# Altium project 2008_SablierElectronique.PrjPcb
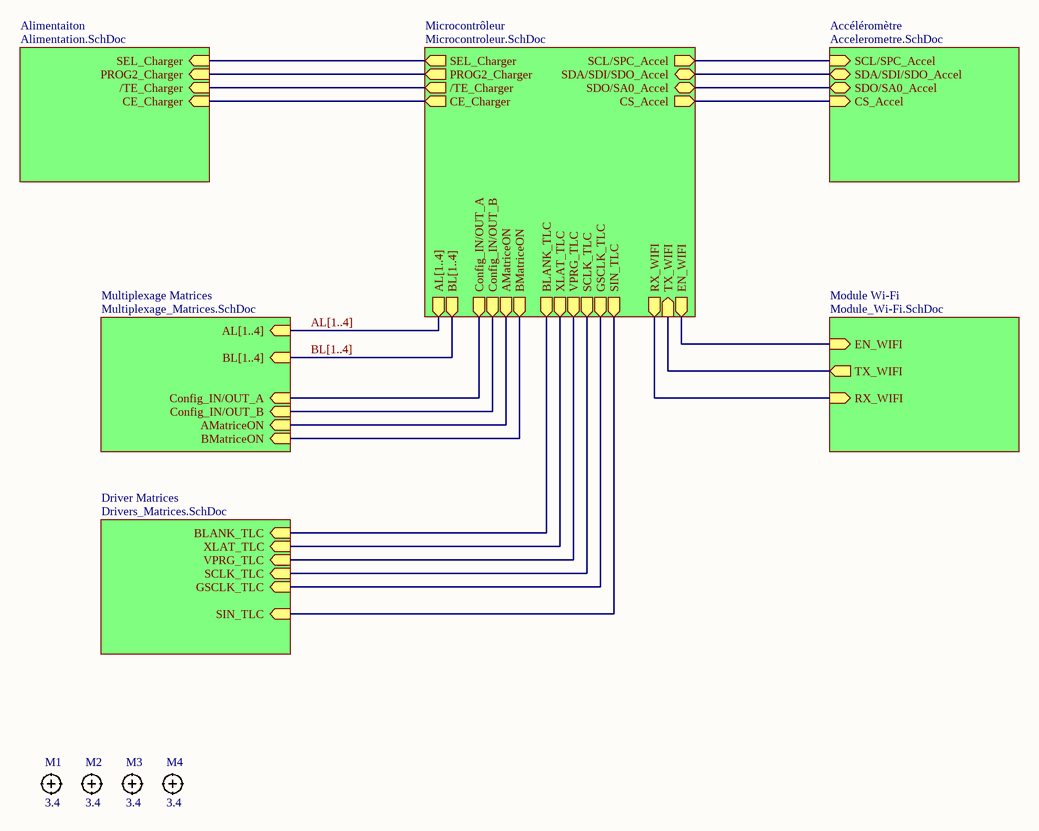
[diagram p0: Schema_bloc.SchDoc]
=ProjectName: 2008_SablierElectronique.PrjPcb
7 sheets, 129 parts. Net scope: hierarchical (ports join the sheet entries above them; power ports are global).
Board file: 2008E_SablierElectronique_JJE.PcbDoc
Sheets:
  Schema_bloc.SchDoc
    Alimentaiton = Alimentation.SchDoc
    Microcontrôleur = Microcontroleur.SchDoc
    Multiplexage Matrices = Multiplexage_Matrices.SchDoc
    Driver Matrices = Drivers_Matrices.SchDoc
    Accéléromètre = Accelerometre.SchDoc
    Module Wi-Fi = Module_Wi-Fi.SchDoc

## Sheet Schema_bloc.SchDoc
size A4; Author: Jérémie Jean-Elie; DrawnBy: Jérémie Jean-Elie; SheetNumber: 1; SheetTotal: 7; Version: E

### Parts
M1  3.4  [MECH-UHD340]  (no BOM)
M2  3.4  [MECH-UHD340]  (no BOM)
M3  3.4  [MECH-UHD340]  (no BOM)
M4  3.4  [MECH-UHD340]  (no BOM)

### Sub-sheets
Accéléromètre = Accelerometre.SchDoc: SCL/SPC_Accel (in), SDA/SDI/SDO_Accel (bidir), SDO/SA0_Accel (bidir), CS_Accel (in)
Alimentaiton = Alimentation.SchDoc: SEL_Charger (in), PROG2_Charger (in), /TE_Charger (in), CE_Charger (in)
Driver Matrices = Drivers_Matrices.SchDoc: BLANK_TLC (in), XLAT_TLC (in), VPRG_TLC (in), SCLK_TLC (in), GSCLK_TLC (in), SIN_TLC (in)
Microcontrôleur = Microcontroleur.SchDoc: SEL_Charger (out), PROG2_Charger (out), /TE_Charger (out), CE_Charger (out), EN_WIFI (out), TX_WIFI (in), RX_WIFI (out), AL[1..4] (out), BL[1..4] (out), BLANK_TLC (out), XLAT_TLC (out), VPRG_TLC (out), SCLK_TLC (out), GSCLK_TLC (out), Config_IN/OUT_B (out), AMatriceON (out), BMatriceON (out), SIN_TLC (out), Config_IN/OUT_A (out), SCL/SPC_Accel (out), SDA/SDI/SDO_Accel (bidir), SDO/SA0_Accel (bidir), CS_Accel (out)
Module Wi-Fi = Module_Wi-Fi.SchDoc: EN_WIFI (in), TX_WIFI (out), RX_WIFI (in)
Multiplexage Matrices = Multiplexage_Matrices.SchDoc: AL[1..4] (in), BL[1..4] (in), Config_IN/OUT_A (in), AMatriceON (in), BMatriceON (in), Config_IN/OUT_B (in)

### Nets
BLANK_TLC: sheet Microcontrôleur/BLANK_TLC, sheet Driver Matrices/BLANK_TLC
CS_Accel: sheet Microcontrôleur/CS_Accel, sheet Accéléromètre/CS_Accel
GSCLK_TLC: sheet Microcontrôleur/GSCLK_TLC, sheet Driver Matrices/GSCLK_TLC
RX_WIFI: sheet Microcontrôleur/RX_WIFI, sheet Module Wi-Fi/RX_WIFI
SCL/SPC_Accel: sheet Microcontrôleur/SCL/SPC_Accel, sheet Accéléromètre/SCL/SPC_Accel
SCLK_TLC: sheet Microcontrôleur/SCLK_TLC, sheet Driver Matrices/SCLK_TLC
SDA/SDI/SDO_Accel: sheet Microcontrôleur/SDA/SDI/SDO_Accel, sheet Accéléromètre/SDA/SDI/SDO_Accel
SDO/SA0_Accel: sheet Microcontrôleur/SDO/SA0_Accel, sheet Accéléromètre/SDO/SA0_Accel
SIN_TLC: sheet Microcontrôleur/SIN_TLC, sheet Driver Matrices/SIN_TLC
TX_WIFI: sheet Microcontrôleur/TX_WIFI, sheet Module Wi-Fi/TX_WIFI
VPRG_TLC: sheet Microcontrôleur/VPRG_TLC, sheet Driver Matrices/VPRG_TLC
XLAT_TLC: sheet Microcontrôleur/XLAT_TLC, sheet Driver Matrices/XLAT_TLC
NetTP7_1: sheet Microcontrôleur/Config_IN/OUT_B, sheet Multiplexage Matrices/Config_IN/OUT_B
NetU2_3: sheet Alimentaiton/SEL_Charger, sheet Microcontrôleur/SEL_Charger
NetU2_4: sheet Alimentaiton/PROG2_Charger, sheet Microcontrôleur/PROG2_Charger
NetU2_9: sheet Alimentaiton//TE_Charger, sheet Microcontrôleur//TE_Charger
NetU2_17: sheet Alimentaiton/CE_Charger, sheet Microcontrôleur/CE_Charger
NetU3_1: sheet Microcontrôleur/Config_IN/OUT_A, sheet Multiplexage Matrices/Config_IN/OUT_A
NetU3_15: sheet Microcontrôleur/AMatriceON, sheet Multiplexage Matrices/AMatriceON
NetU4_15: sheet Microcontrôleur/BMatriceON, sheet Multiplexage Matrices/BMatriceON
NetU7_60: sheet Microcontrôleur/EN_WIFI, sheet Module Wi-Fi/EN_WIFI

### Buses and harness runs
bus AL[1..4] = sheet Microcontrôleur/AL[1..4] = sheet Multiplexage Matrices/AL[1..4]
bus BL[1..4] = sheet Microcontrôleur/BL[1..4] = sheet Multiplexage Matrices/BL[1..4]

### Notes on the sheet
- Fichier :
- a
- Date :
- Heure :
- Version :
- Auteur :
- Modif.
- b
- c
- d
- Projet :
- No :
- Nb feuilles
- Feuille n°
- Chemin :

### Library data of the parts
M1-M4 = CMP-063-000009-1: Unplated Hole 3.4mm; PN: PN-491366; IsStocked: False; SubCategory: Mecaniques; Category: Others; Value: 3.4

## Sheet Alimentation.SchDoc
size A4; Author: Jérémie Jean-Elie; Organization: ETML-ES; Address1: Avenue Recordon 1; Address2: 1004 Lausanne; Address3: Switzerland; Revision: 1; SheetNumber: 2; SheetTotal: 7; Version: E
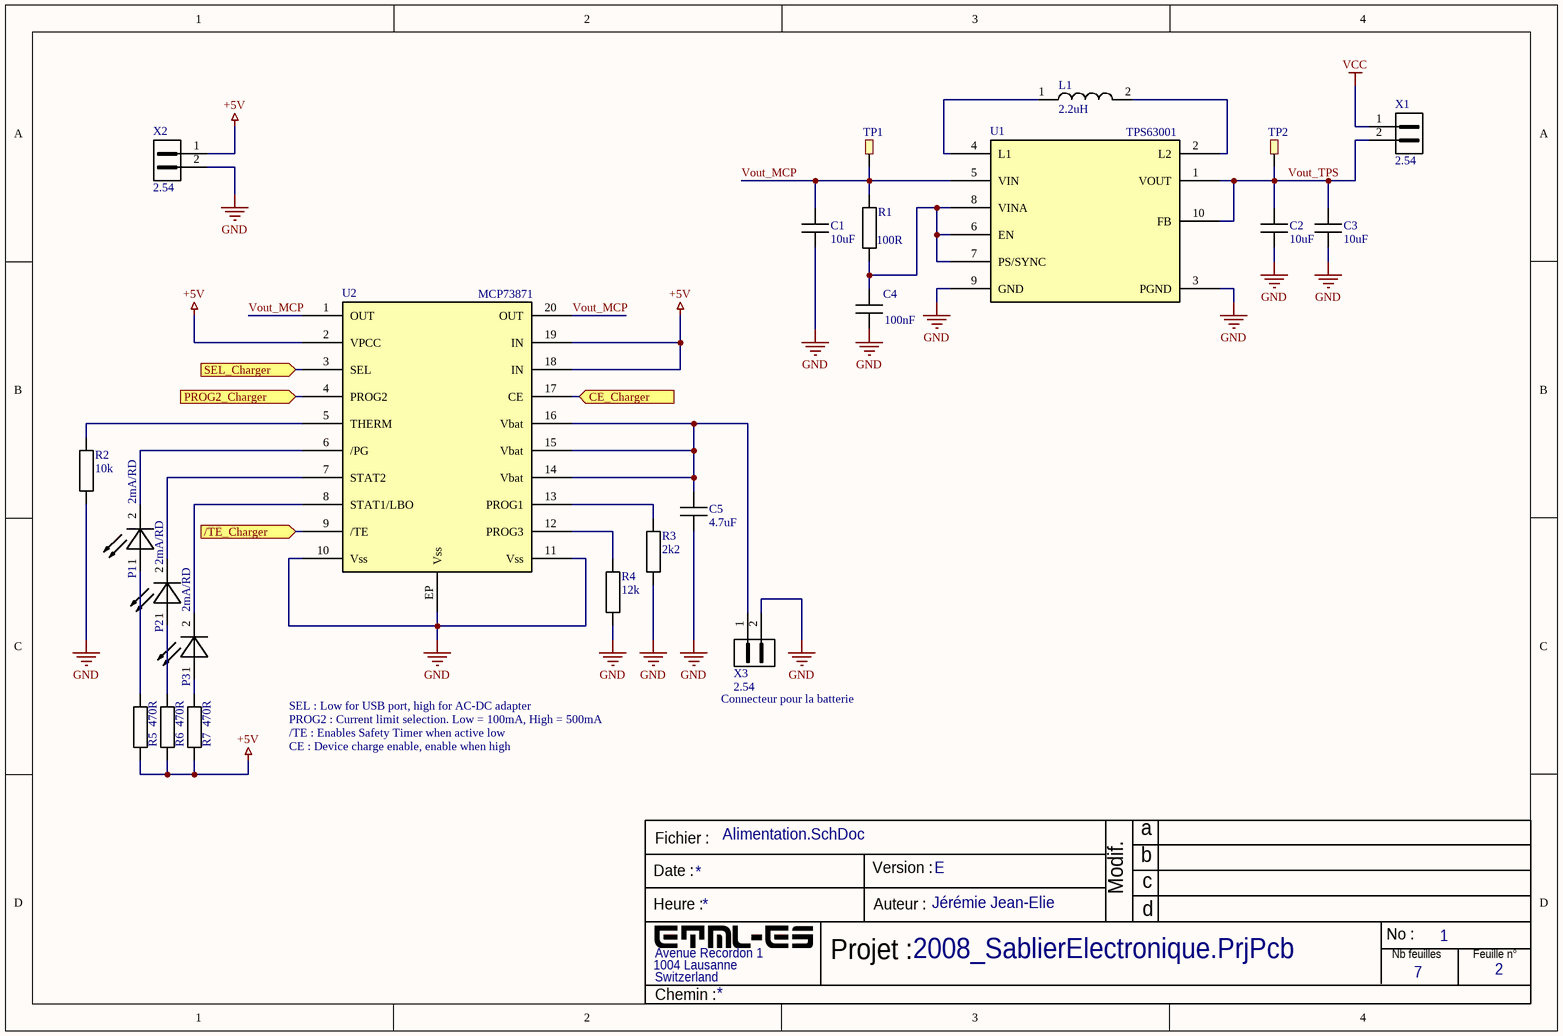
[diagram p1: Alimentation.SchDoc]

### Parts
C1  10uF  [CAPC1608X08M]
C2  10uF  [CAPC1608X08M]
C3  10uF  [CAPC1608X08M]
C4  100nF  [CAPC1608X08M]
C5  4.7uF  [CAPC1608X08M]
L1  2.2uH  [IND_2.2uH]
P1  2mA/RD  [LED-PLCC2]
P2  2mA/RD  [LED-PLCC2]
P3  2mA/RD  [LED-PLCC2]
R1  100R  [RESC1608X06M]
R2  10k  [RESC1608X06M]
R3  2k2  [RESC1608X06M]
R4  12k  [RESC1608X06M]
R5  470R  [RESC1608X06M]
R6  470R  [RESC1608X06M]
R7  470R  [RESC1608X06M]
TP1  TestPoint  [KEYSTONE_5019]  (value not drawn)
TP2  TestPoint  [KEYSTONE_5019]  (value not drawn)
U1  TPS63001  [DRC0010J]
U2  MCP73871  [QFN50P400X400X100_HS-21N]
X1  2.54  [PIN-1x02-2.54]
X2  2.54  [PIN-1x02-2.54]
X3  2.54  [PIN-1x02-2.54]

### Ports
/TE_Charger (in, see Schema_bloc[2A], Microcontroleur[4B]), CE_Charger (in, see Schema_bloc[2A], Microcontroleur[4B]), PROG2_Charger (in, see Schema_bloc[2A], Microcontroleur[4B]), SEL_Charger (in, see Schema_bloc[2A], Microcontroleur[4B])

### Nets
+5V: R5.1 R6.1 R7.1 U2.2(VPCC) U2.18(IN) U2.19(IN) X2.1
GND: C1.1 C2.1 C3.1 C4.1 C5.1 R2.1 R3.1 R4.1 U1.3(PGND) U1.9(GND) U2.10(Vss) U2.11(Vss) U2.EP(Vss) X2.2 X3.2
VCC: X1.1
Vout_MCP: C1.2 R1.2 TP1.1 U1.5(VIN) U2.1(OUT) U2.20(OUT)
Vout_TPS: C2.2 C3.2 TP2.1 U1.1(VOUT) U1.10(FB) X1.2
NetC4_2: C4.2 R1.1 U1.6(EN) U1.7(PS/SYNC) U1.8(VINA)
NetC5_2: C5.2 U2.14(Vbat) U2.15(Vbat) U2.16(Vbat) X3.1
NetL1_1: L1.1 U1.4(L1)
NetL1_2: L1.2 U1.2(L2)
NetP1_1: P1.1(A) R5.2
NetP1_2: P1.2(K) U2.6(/PG)
NetP2_1: P2.1(A) R6.2
NetP2_2: P2.2(K) U2.7(STAT2)
NetP3_1: P3.1(A) R7.2
NetP3_2: P3.2(K) U2.8(STAT1/LBO)
NetR2_2: R2.2 U2.5(THERM)
NetR3_2: R3.2 U2.13(PROG1)
NetR4_2: R4.2 U2.12(PROG3)
NetU2_3: U2.3(SEL) ; port SEL_Charger
NetU2_4: U2.4(PROG2) ; port PROG2_Charger
NetU2_9: U2.9(/TE) ; port /TE_Charger
NetU2_17: U2.17(CE) ; port CE_Charger

### Notes on the sheet
- SEL : Low for USB port, high for AC-DC adapter
- Connecteur pour la batterie
- PROG2 : Current limit selection. Low = 100mA, High = 500mA
- /TE : Enables Safety Timer when active low
- CE : Device charge enable, enable when high
- Fichier :
- a
- Date :
- Heure :
- Version :
- Auteur :
- Modif.
- b
- c
- d
- Projet :
- No :
- Nb feuilles
- Feuille n°
- Chemin :

### Library data of the parts
C1-C3 = CMP-065-000003-2: CAPC 10uF X5R 10V 20% 1608 (0603 INCH); Manufacturer: TDK; Manufacturer Number: C1608X5R1A106M080AC; TemperatureRange: -55°C to +85°C; IsStocked: 1; Value: 10µF; PN: PN-131657; Supplier Price 1: 0.0944; Tolerance: ±20%; Category: Passives; Dielectric: X5R; SubCategory: Condensateurs ceramique; Supplier 1: ETML; Voltage: 10V; Supplier Part Number 1: FAB.0603_C 10uF
C4 = CMP-065-000000-2: CAPC 100nF X7R 50V 10% 1608 (0603 INCH); Manufacturer: TDK; Manufacturer Number: CGA3E2X7R1H104K080AA; IsStocked: 1; PN: PN-338083; Current: NULL; TemperatureRange: -55°C to +125°C; Voltage: 50V; Dielectric: X7R; Value: 100nF; Category: Passives; Supplier Price 1: 0.0100; Supplier Part Number 1: FAB.0603_C 100n; SubCategory: Condensateurs ceramique; Tolerance: ±10%; Supplier 1: ETML; TemperatureCoeff: NULL; Power: NULL
C5 = CMP-065-000006-2: CAPC 4.7uF X5R 16V 10% 1608 (0603 INCH); Manufacturer: TDK; Manufacturer Number: C1608X5R1C475K080AC; TemperatureRange: -55°C to +85°C; IsStocked: 1; Value: 4.7µF; PN: PN-938781; Voltage: 16V; SubCategory: Condensateurs ceramique; Tolerance: ±10%; Dielectric: X5R; Supplier Price 1: 0.0453; Supplier Part Number 1: FAB.0603_C 4.7uF; Supplier 1: ETML; Category: Passives
P1-P3 = CMP-062-000009-1: LED 2 mA 2.2V 625nm Red PLCC2; Manufacturer Number: VLMT3100-GS08; Manufacturer: Vishay; Current: 2mA; TemperatureRange: -40°C to +100°C; PN: PN-800195; IsStocked: True; Supplier 1: Farnell; Value: 2mA/RD; Category: Optoelectronics; Supplier Price 1: 0.179; Supplier Part Number 1: 2251489; Voltage: 2.2V; SubCategory: Leds
R1 = CMP-066-000100-2: RES 100ohm  ±1% 0.1W  1608 (0603 INCH); Manufacturer Number: RC0603FR-07100RL; Manufacturer: Yageo; TemperatureCoeff: ±100ppm/°C; Voltage: 75V; PN: PN-739787; TemperatureRange: -55°C to 155°C; Value: 100; IsStocked: 1; Supplier Price 1: 0.0200; Category: Passives; Tolerance: ±1%; Supplier 1: ETML; Supplier Part Number 1: FAB.0603_R 100R; Power: 0.1W; SubCategory: Resistances couche epaisse
R2 = CMP-066-000124-2: RES 10kohm  ±1% 0.1W  1608 (0603 INCH); Manufacturer Number: RC0603FR-0710KL; Manufacturer: Yageo; TemperatureRange: -55°C to 155°C; Voltage: 75V; TemperatureCoeff: ±100ppm/°C; PN: PN-896786; IsStocked: 1; Category: Passives; Tolerance: ±1%; Value: 10k; Supplier Part Number 1: FAB.0603_R 10k; Power: 0.1W; Supplier Price 1: 0.0200; Supplier 1: ETML; SubCategory: Resistances couche epaisse
R3 = CMP-066-000116-2: RES 2.2kohm  ±1% 0.1W  1608 (0603 INCH); Manufacturer Number: RC0603FR-072K2L; Manufacturer: Yageo; TemperatureCoeff: ±100ppm/°C; TemperatureRange: -55°C to 155°C; IsStocked: 1; Voltage: 75V; PN: PN-844453; Value: 2.2k; Power: 0.1W; Category: Passives; Supplier Part Number 1: FAB.0603_R 2k2; Supplier 1: ETML; SubCategory: Resistances couche epaisse; Supplier Price 1: 0.0200; Tolerance: ±1%
R4 = CMP-066-000125-2: RES 12kohm  ±1% 0.1W  1608 (0603 INCH); Manufacturer Number: RC0603FR-0712KL; Manufacturer: Yageo; IsStocked: 1; Voltage: 75V; TemperatureCoeff: ±100ppm/°C; TemperatureRange: -55°C to 155°C; PN: PN-565828; Value: 12k; Tolerance: ±1%; Supplier Price 1: 0.0200; Supplier Part Number 1: FAB.0603_R 12k; Power: 0.1W; Category: Passives; SubCategory: Resistances couche epaisse; Supplier 1: ETML
R5-R7 = CMP-066-000108-2: RES 470ohm  ±1% 0.1W  1608 (0603 INCH); Manufacturer Number: RC0603FR-07470RL; Manufacturer: Yageo; Voltage: 75V; Value: 470; TemperatureCoeff: ±100ppm/°C; PN: PN-792120; TemperatureRange: -55°C to 155°C; IsStocked: 1; SubCategory: Resistances couche epaisse; Power: 0.1W; Tolerance: ±1%; Category: Passives; Supplier 1: ETML; Supplier Price 1: 0.0200; Supplier Part Number 1: FAB.0603_R 470R
X1-X3 = CMP-055-000006-1: PIN HEADER 2.54 1x02; Manufacturer Number: 61300211121; Manufacturer: Würth Electronik; IsStocked: True; PN: PN-573903; Voltage: 250V; Current: 3A; TemperatureRange: -40°C to +105°C; Supplier Part Number 1: MAG.283.897; Supplier Price 1: 0.04; Supplier 1: ETML; SubCategory: Pin Header; Category: Connectors; Value: 2.54
U1 = TPS63001: Supplier 1: DigiKey; Supplier Part Number 1: 296-32517-1-ND

## Sheet Microcontroleur.SchDoc
size A3; Version: E; Author: Jérémie Jean-Elie; Organization: ETML-ES; Address1: Avenue Recordon 1; Address2: 1004 Lausanne; Address3: Switzerland; Revision: 1; SheetNumber: 5; SheetTotal: 7
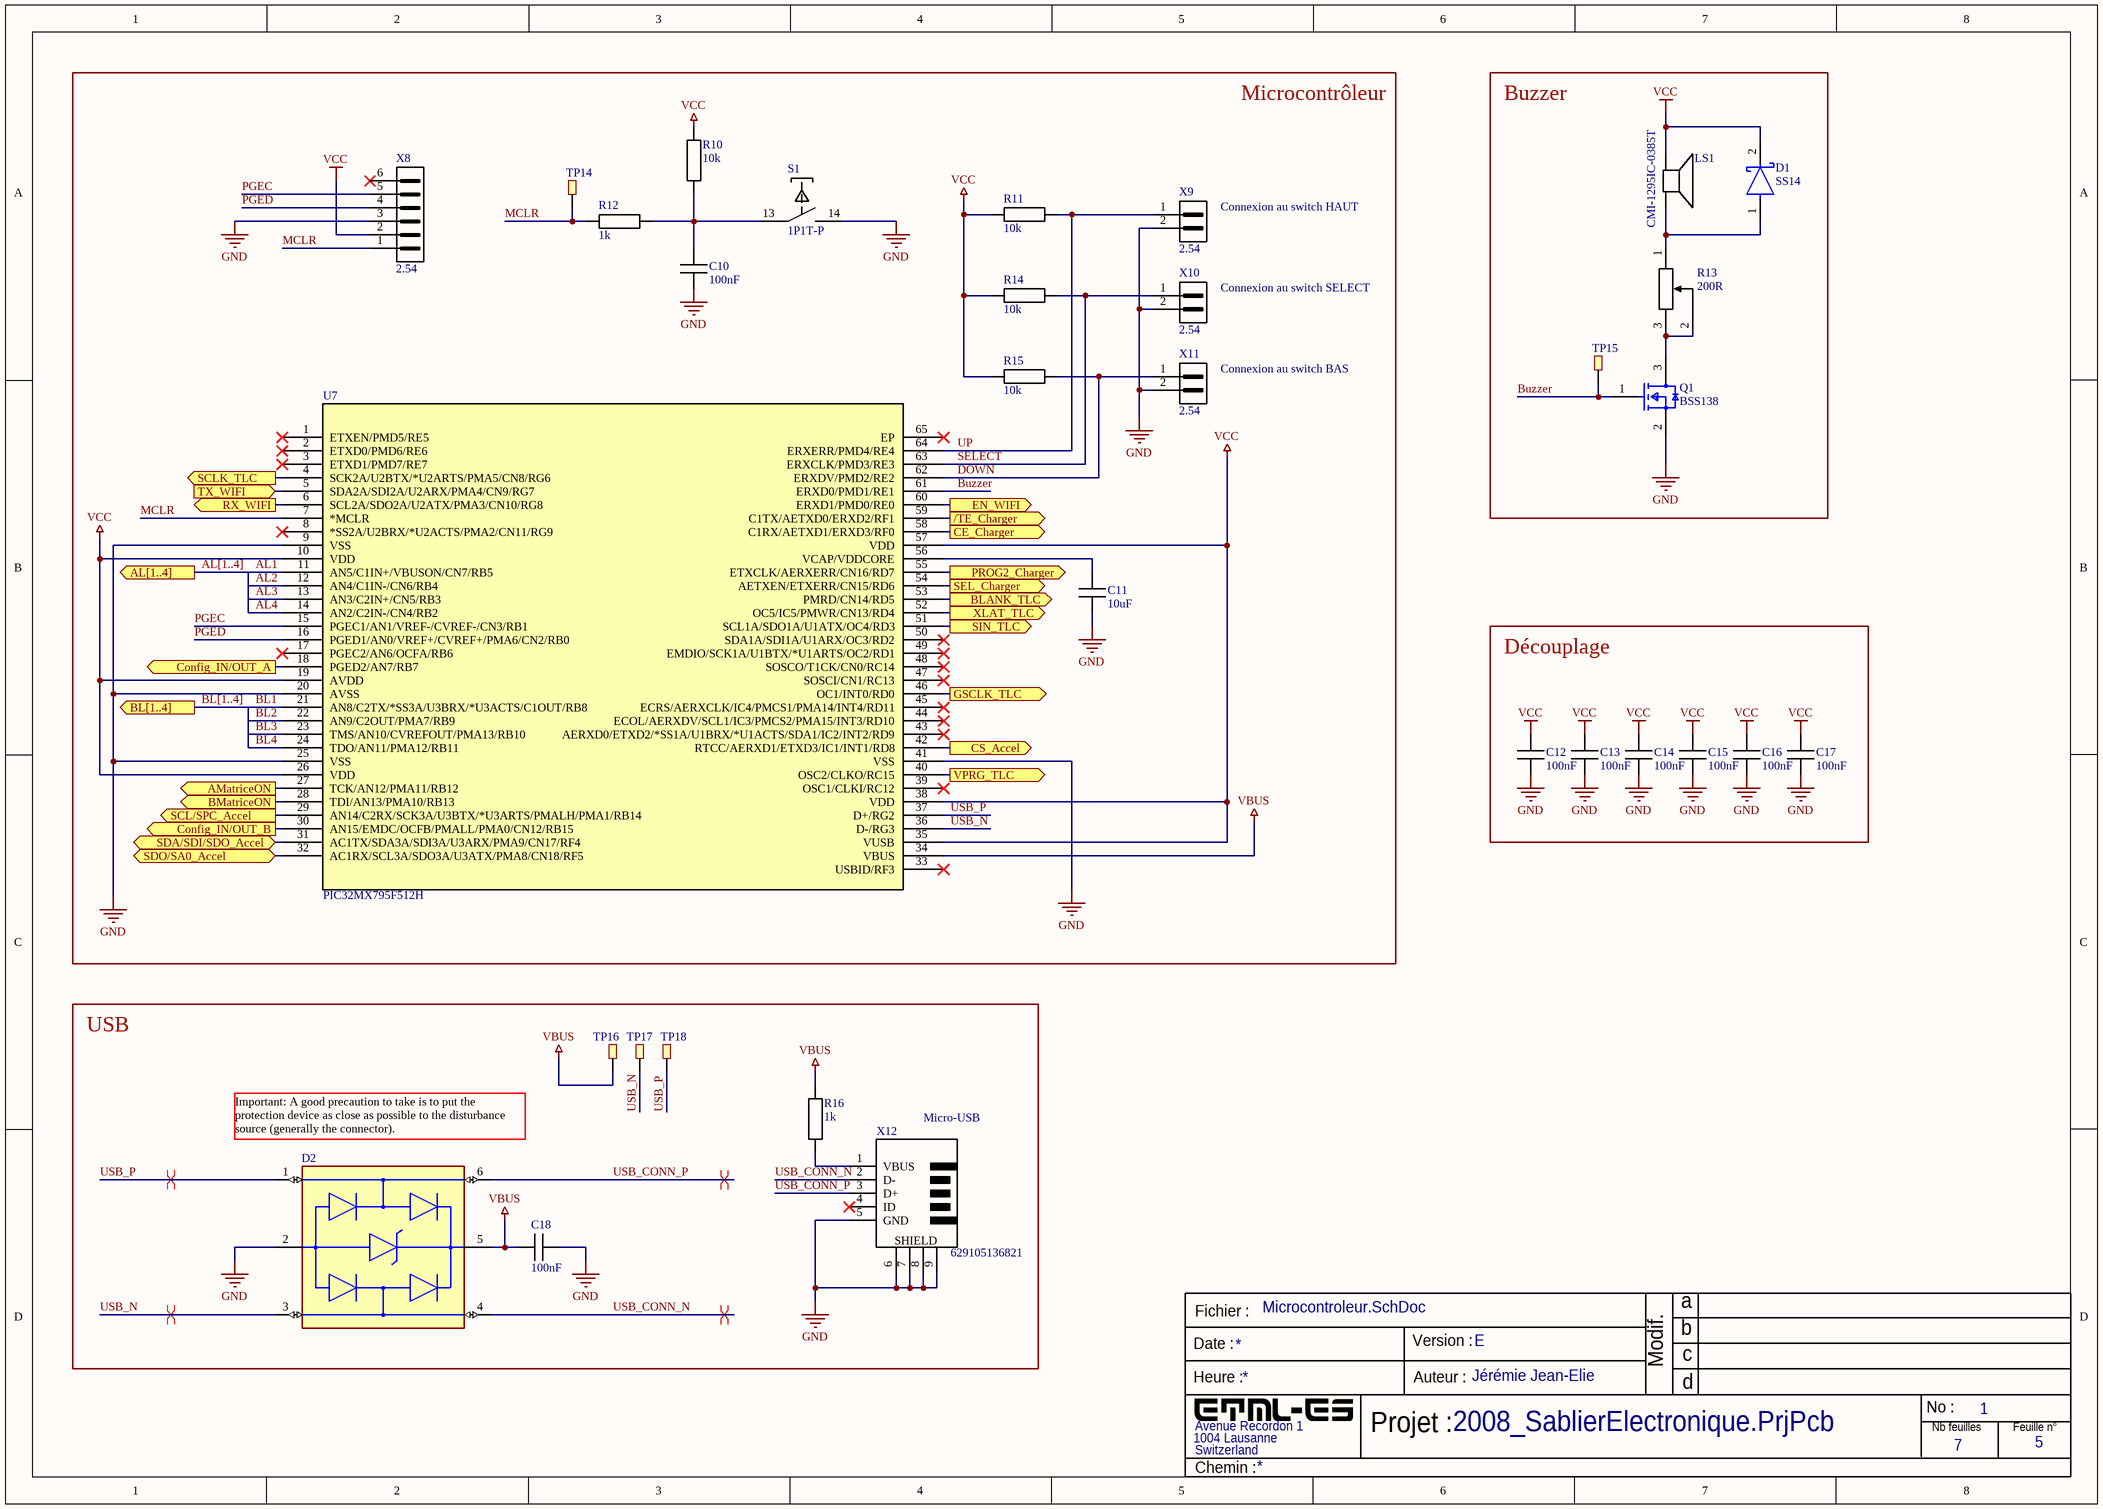
[diagram p2: Microcontroleur.SchDoc]

### Parts
C10  100nF  [CAPC1608X08M]
C11  10uF  [CAPC1608X08M]
C12  100nF  [CAPC1608X08M]
C13  100nF  [CAPC1608X08M]
C14  100nF  [CAPC1608X08M]
C15  100nF  [CAPC1608X08M]
C16  100nF  [CAPC1608X08M]
C17  100nF  [CAPC1608X08M]
C18  100nF  [CAPC1608X08M]
D1  SS14  [FP-403AE-MFG]
D2  USBLC6-2P6  [SOT95P280X145-6N]  (value not drawn)
LS1  CMI-1295IC-0385T  [CMI-1295IC-0385T]
Q1  BSS138  [FP-318-08-IPC_B]
R10  10k  [RESC1608X06M]
R11  10k  [RESC1608X06M]
R12  1k  [RESC1608X06M]
R13  200R  [POT_200r]
R14  10k  [RESC1608X06M]
R15  10k  [RESC1608X06M]
R16  1k  [RESC1608X06M]
S1  1P1T-P  [TE_1825910-6]
TP14  TestPoint  [KEYSTONE_5019]  (value not drawn)
TP15  TestPoint  [KEYSTONE_5019]  (value not drawn)
TP16  TestPoint  [KEYSTONE_5019]  (value not drawn)
TP17  TestPoint  [KEYSTONE_5019]  (value not drawn)
TP18  TestPoint  [KEYSTONE_5019]  (value not drawn)
U7  PIC32MX795F512H  [TQFP64_10x10MC_MCH]
X8  2.54  [PIN-1x06-2.54]
X9  2.54  [PIN-1x02-2.54]
X10  2.54  [PIN-1x02-2.54]
X11  2.54  [PIN-1x02-2.54]
X12  629105136821  [WE_629105136821]

### Blocks framed on the sheet
Microcontrôleur: C10 C11 R10-R12 R14 R15 S1 TP14 U7 X8-X11
Buzzer: D1 LS1 Q1 R13 TP15
Découplage: C12-C17
USB: C18 D2 R16 TP16-TP18 X12

### Ports
/TE_Charger (out, see Schema_bloc[2A], Alimentation[1C]), AL[1..4] (out, see Schema_bloc[2B], Multiplexage_Matrices[3B]), AMatriceON (out, see Schema_bloc[2B], Multiplexage_Matrices[2B]), BL[1..4] (out, see Schema_bloc[2B], Multiplexage_Matrices[3C]), BLANK_TLC (out, see Schema_bloc[2B], Drivers_Matrices[1A]), BMatriceON (out, see Schema_bloc[2B], Multiplexage_Matrices[2C]), CE_Charger (out, see Schema_bloc[2A], Alimentation[2B]), Config_IN/OUT_A (out, see Schema_bloc[2B], Multiplexage_Matrices[1A]), Config_IN/OUT_B (out, see Schema_bloc[2B], Multiplexage_Matrices[1B]), CS_Accel (out, see Schema_bloc[3A], Accelerometre[1B]), EN_WIFI (out, see Schema_bloc[3B], Module_Wi-Fi[1A]), GSCLK_TLC (out, see Schema_bloc[3B], Drivers_Matrices[1A]), PROG2_Charger (out, see Schema_bloc[2A], Alimentation[1B]), RX_WIFI (out, see Schema_bloc[3B], Module_Wi-Fi[1B]), SCL/SPC_Accel (out, see Schema_bloc[3A], Accelerometre[1B]), SCLK_TLC (out, see Schema_bloc[2B], Drivers_Matrices[1A]), SDA/SDI/SDO_Accel (bidir, see Schema_bloc[3A], Accelerometre[1B]), SDO/SA0_Accel (bidir, see Schema_bloc[3A], Accelerometre[1B]), SEL_Charger (out, see Schema_bloc[2A], Alimentation[1B]), SIN_TLC (out, see Schema_bloc[3B], Drivers_Matrices[1B]), TX_WIFI (in, see Schema_bloc[3B], Module_Wi-Fi[1B]), VPRG_TLC (out, see Schema_bloc[2B], Drivers_Matrices[1A]), XLAT_TLC (out, see Schema_bloc[2B], Drivers_Matrices[1A])

### Nets
GND: C10.1 C11.1 C12.1 C13.1 C14.1 C15.1 C16.1 C17.1 C18.2 D2.2(GND) Q1.2(S) S1.14 U7.9(VSS) U7.20(AVSS) U7.25(VSS) U7.41(VSS) X8.3 X9.2 X10.2 X11.2 X12.5(GND) X12.6(SHIELD) X12.7(SHIELD) X12.8(SHIELD) X12.9(SHIELD)
VBUS: C18.1 D2.5(VBUS) R16.2 TP16.1 U7.34(VBUS)
VCC: C12.2 C13.2 C14.2 C15.2 C16.2 C17.2 D1.2(C) LS1.1(+) R10.2 R11.2 R14.2 R15.2 U7.10(VDD) U7.19(AVDD) U7.26(VDD) U7.35(VUSB) U7.38(VDD) U7.57(VDD) X8.2
AL1: U7.11(AN5/C1IN+/VBUSON/CN7/RB5)
AL2: U7.12(AN4/C1IN-/CN6/RB4)
AL3: U7.13(AN3/C2IN+/CN5/RB3)
AL4: U7.14(AN2/C2IN-/CN4/RB2)
BL1: U7.21(AN8/C2TX/*SS3A/U3BRX/*U3ACTS/C1OUT/RB8)
BL2: U7.22(AN9/C2OUT/PMA7/RB9)
BL3: U7.23(TMS/AN10/CVREFOUT/PMA13/RB10)
BL4: U7.24(TDO/AN11/PMA12/RB11)
BLANK_TLC: U7.53(PMRD/CN14/RD5) ; port BLANK_TLC
Buzzer: Q1.1(G) TP15.1 U7.61(ERXD0/PMD1/RE1)
CS_Accel: U7.42(RTCC/AERXD1/ETXD3/IC1/INT1/RD8) ; port CS_Accel
DOWN: R15.1 U7.62(ERXDV/PMD2/RE2) X11.1
GSCLK_TLC: U7.46(OC1/INT0/RD0) ; port GSCLK_TLC
MCLR: R12.1 TP14.1 U7.7(*MCLR) X8.1
PGEC: U7.15(PGEC1/AN1/VREF-/CVREF-/CN3/RB1) X8.5
PGED: U7.16(PGED1/AN0/VREF+/CVREF+/PMA6/CN2/RB0) X8.4
RX_WIFI: U7.6(SCL2A/SDO2A/U2ATX/PMA3/CN10/RG8) ; port RX_WIFI
SCL/SPC_Accel: U7.29(AN14/C2RX/SCK3A/U3BTX/*U3ARTS/PMALH/PMA1/RB14) ; port SCL/SPC_Accel
SCLK_TLC: U7.4(SCK2A/U2BTX/*U2ARTS/PMA5/CN8/RG6) ; port SCLK_TLC
SDA/SDI/SDO_Accel: U7.31(AC1TX/SDA3A/SDI3A/U3ARX/PMA9/CN17/RF4) ; port SDA/SDI/SDO_Accel
SDO/SA0_Accel: U7.32(AC1RX/SCL3A/SDO3A/U3ATX/PMA8/CN18/RF5) ; port SDO/SA0_Accel
SELECT: R14.1 U7.63(ERXCLK/PMD3/RE3) X10.1
SIN_TLC: U7.51(SCL1A/SDO1A/U1ATX/OC4/RD3) ; port SIN_TLC
TX_WIFI: U7.5(SDA2A/SDI2A/U2ARX/PMA4/CN9/RG7) ; port TX_WIFI
UP: R11.1 U7.64(ERXERR/PMD4/RE4) X9.1
USB_CONN_N: D2.4(I/O2) X12.2(D-)
USB_CONN_P: D2.6(I/O1) X12.3(D+)
USB_N: D2.3(I/O2) TP17.1 U7.36(D-/RG3)
USB_P: D2.1(I/O1) TP18.1 U7.37(D+/RG2)
VPRG_TLC: U7.40(OSC2/CLKO/RC15) ; port VPRG_TLC
XLAT_TLC: U7.52(OC5/IC5/PMWR/CN13/RD4) ; port XLAT_TLC
NetC10_2: C10.2 R10.1 R12.2 S1.13
NetC11_2: C11.2 U7.56(VCAP/VDDCORE)
NetD1_1: D1.1(A) LS1.2(-) R13.1
NetQ1_3: Q1.3(D) R13.2 R13.3
NetR16_1: R16.1 X12.1(VBUS)
NetTP7_1: U7.30(AN15/EMDC/OCFB/PMALL/PMA0/CN12/RB15) ; port Config_IN/OUT_B
NetU2_3: U7.54(AETXEN/ETXERR/CN15/RD6) ; port SEL_Charger
NetU2_4: U7.55(ETXCLK/AERXERR/CN16/RD7) ; port PROG2_Charger
NetU2_9: U7.59(C1TX/AETXD0/ERXD2/RF1) ; port /TE_Charger
NetU2_17: U7.58(C1RX/AETXD1/ERXD3/RF0) ; port CE_Charger
NetU3_1: U7.18(PGED2/AN7/RB7) ; port Config_IN/OUT_A
NetU3_15: U7.27(TCK/AN12/PMA11/RB12) ; port AMatriceON
NetU4_15: U7.28(TDI/AN13/PMA10/RB13) ; port BMatriceON
NetU7_60: U7.60(ERXD1/PMD0/RE0) ; port EN_WIFI

Not connected (* = marked no-connect by the designer): U7 1(ETXEN/PMD5/RE5)* 2(ETXD0/PMD6/RE6)* 3(ETXD1/PMD7/RE7)* 8(*SS2A/U2BRX/*U2ACTS/PMA2/CN11/RG9)* 17(PGEC2/AN6/OCFA/RB6)* 33(USBID/RF3)* 39(OSC1/CLKI/RC12)* 43(AERXD0/ETXD2/*SS1A/U1BRX/*U1ACTS/SDA1/IC2/INT2/RD9)* 44(ECOL/AERXDV/SCL1/IC3/PMCS2/PMA15/INT3/RD10)* 45(ECRS/AERXCLK/IC4/PMCS1/PMA14/INT4/RD11)* 47(SOSCI/CN1/RC13)* 48(SOSCO/T1CK/CN0/RC14)* 49(EMDIO/SCK1A/U1BTX/*U1ARTS/OC2/RD1)* 50(SDA1A/SDI1A/U1ARX/OC3/RD2)* 65(EP)*; X8 6*; X12 4(ID)*

### Buses and harness runs
bus AL[1..4] = port AL[1..4]
bus BL[1..4] = port BL[1..4]

### Layout directives
differential pair; rule Differential Pairs Routing [Pref Gap = 0.254mm    Min Gap  = 0.254mm    Max Gap  = 0.254mmPref Width = 0.381mm    Min Width  = 0.381mm    Max Width  = 0.381mm]; differential pair class USB_CONN_LINES: USB_CONN_N, USB_CONN_P
differential pair; rule Differential Pairs Routing [Pref Gap = 0.254mm    Min Gap  = 0.254mm    Max Gap  = 0.254mmPref Width = 0.381mm    Min Width  = 0.381mm    Max Width  = 0.381mm]; differential pair class USB_LINES: USB_N, USB_P

### Notes on the sheet
- (near X9) Connexion au switch HAUT
- (near X10) Connexion au switch SELECT
- (near X11) Connexion au switch BAS
- (near X12) Micro-USB
- (near D2) Important: A good precaution to take is to put the protection device as close as possible to the disturbance
  source (generally the connector).
- Fichier :
- a
- Date :
- Heure :
- Version :
- Auteur :
- Modif.
- b
- c
- d
- Projet :
- No :
- Nb feuilles
- Feuille n°
- Chemin :

### Library data of the parts
C10 C12-C18 = CMP-065-000000-2: as C4 on sheet Alimentation; Voltage: 50V; Dielectric: X7R; Value: 100nF; Category: Passives; Supplier Price 1: 0.0100; Supplier Part Number 1: FAB.0603_C 100n; SubCategory: Condensateurs ceramique; Tolerance: ±10%; Supplier 1: ETML; TemperatureCoeff: NULL; Power: NULL
C11 = CMP-065-000003-2: as C1 on sheet Alimentation; Supplier Price 1: 0.0944; Tolerance: ±20%; Category: Passives; Dielectric: X5R; SubCategory: Condensateurs ceramique; Supplier 1: ETML; Voltage: 10V; Supplier Part Number 1: FAB.0603_C 10uF
D1 = CMP-2000-04943-2: DIODE SCHOTTKY 40V 1A SMA; Manufacturer: ON Semiconductor; Peak Reverse Current: 0.2mA; Max Junction Temp: +125°C; Standoff Height: 0.05mm; Max Surge Forward Current: 40A; Mouser Description: Schottky Diodes & Rectifiers SMA 40V 1.0A; RoHS: TRUE; Lead Free: Yes; Manufacturer Part Number: SS14; Device Class L3: Schottky Diodes; Category: Diode; Automotive: No; Digikey Description: DIODE SCHOTTKY 40V 1A SMA; ComponentLink2Description: Datasheet; Device Class L2: Diodes; Height: 2.5mm; Temperature Range High: +125°C; ComponentLink2URL: https://www.onsemi.com/pub/Collateral/SS19-D.PDF; Device Class L1: Discrete Semiconductors; Package: 403AE; Octopart: https://octopart.com/ss14-on+semiconductor-29205033; Max Repetitive Reverse Voltage: 40V; Temperature Range Low: -65°C; Forward Current: 1A; Temperature: -65°C to +125°C
LS1 = CMI-1295IC-0385T: 12 mm, 3 Vdc, 85 dB, Through Hole, Driving Circuit, Magnetic Audio Indicator Buzzer; Supplier 1: Mouser; Supplier Part Number 1: 490-CMI-1295IC-0385T
Q1 = CMP-07173-000101-1: MOSFET N-CH 50V 220MA SOT-23; Turn-Off Delay Time: 20ns; Element Configuration: Single; Rds On Max: 3.5R; Gate to Source Voltage (Vgs): 20V; Threshold Voltage: 1.3V; Number of Elements: 1; Power Dissipation: 360mW; Rise Time: 9ns; Turn-On Delay Time: 2.5ns; Input Capacitance: 27pF; On-State Resistance: 6R; Lead Free: Lead Free; Length: 2.92mm; Width: 1.3mm; Drain to Source Breakdown Voltage: 50V; Min Operating Temperature: -55°C; REACH SVHC: No SVHC; Packaging: Tape and Reel; Radiation Hardening: No; Height: 0.93mm; Drain to Source Voltage (Vdss): 50V; Current Rating: 220mA; Voltage Rating (DC): 50V; Weight: 0.03g; Continuous Drain Current (ID): 220mA; Number of Pins: 3; Nominal Vgs: 1.3V; Max Power Dissipation: 360mW; Fall Time: 9ns; Drain to Source Resistance: 3.5R; Contact Plating: Tin; Case/Package: SOT-23; Package Quantity: 1; Dual Supply Voltage: 50V; Mount: Surface Mount; Termination: SMD/SMT; Max Operating Temperature: 150°C
R10 R11 R14 R15 = CMP-066-000124-2: as R2 on sheet Alimentation; Category: Passives; Tolerance: ±1%; Value: 10k; Supplier Part Number 1: FAB.0603_R 10k; Power: 0.1W; Supplier Price 1: 0.0200; Supplier 1: ETML; SubCategory: Resistances couche epaisse
R12 R16 = CMP-066-000112-2: RES 1.0kohm  ±1% 0.1W  1608 (0603 INCH); Manufacturer Number: RC0603FR-071KL; Manufacturer: Yageo; TemperatureRange: -55°C to 155°C; PN: PN-368287; IsStocked: 1; Voltage: 75V; TemperatureCoeff: ±100ppm/°C; Power: 0.1W; Tolerance: ±1%; Supplier Price 1: 0.0100; Category: Passives; Value: 1k; SubCategory: Resistances couche epaisse; Supplier 1: ETML; Supplier Part Number 1: FAB.0603_R 1k
R13 = Pot_200R: Value: 200R
S1 = CMP-058-000005-2: SW 600X600X500 24V 50mA THT; Manufacturer Number: 1825910-6; Manufacturer: TE Connectivity; TemperatureRange: -35°C to +85 °C; IsStocked: True; PN: PN-638027; Voltage: 24V; Current: 50mA; SubCategory: Commutateurs; Category: Electromechanical; Supplier Part Number 1: 135-66-547; Supplier 1: Distrelec AG; Supplier Price 1: 0.1642; Value: 1P1T-P
X8 = CMP-055-000011-1: PIN HEADER 2.54 1x06; Manufacturer Number: 61300411121; Manufacturer: Würth Electronik; IsStocked: True; PN: PN-823777; TemperatureRange: -40°C to +105°C; Voltage: 250V; Current: 3A; Supplier Part Number 1: MAG.283.897; Value: 2.54; Category: Connectors; Supplier Price 1: 1.2; Supplier 1: ETML; SubCategory: Pin Header
X9-X11 = CMP-055-000006-1: as X1 on sheet Alimentation; Supplier Part Number 1: MAG.283.897; Supplier Price 1: 0.04; Supplier 1: ETML; SubCategory: Pin Header; Category: Connectors; Value: 2.54
X12 = CMP-054-000011-1: USB MICRO 5P Horizontal SMT; Manufacturer: Würth Electronik; PN: PN-869488; TemperatureRange: -40°C to +85°C; IsStocked: True; SubCategory: USB; Value: 629105136821; Supplier 1: ETML; Category: Connectors; Manufacturer Number: 629105136821; Supplier Price 1: 1.48; Supplier Part Number 1: MAG.246.110
D2 = USBLC6-2P6: Supplier 1: Mouser; Supplier Part Number 1: 511-USBLC6-2P6

## Sheet Multiplexage_Matrices.SchDoc
size A3; Author: Jérémie Jean-Elie; Organization: ETML-ES; Address1: Avenue Recordon 1; Address2: 1004 Lausanne; Address3: Switzerland; Revision: 1; SheetNumber: 3; SheetTotal: 7; Version: E
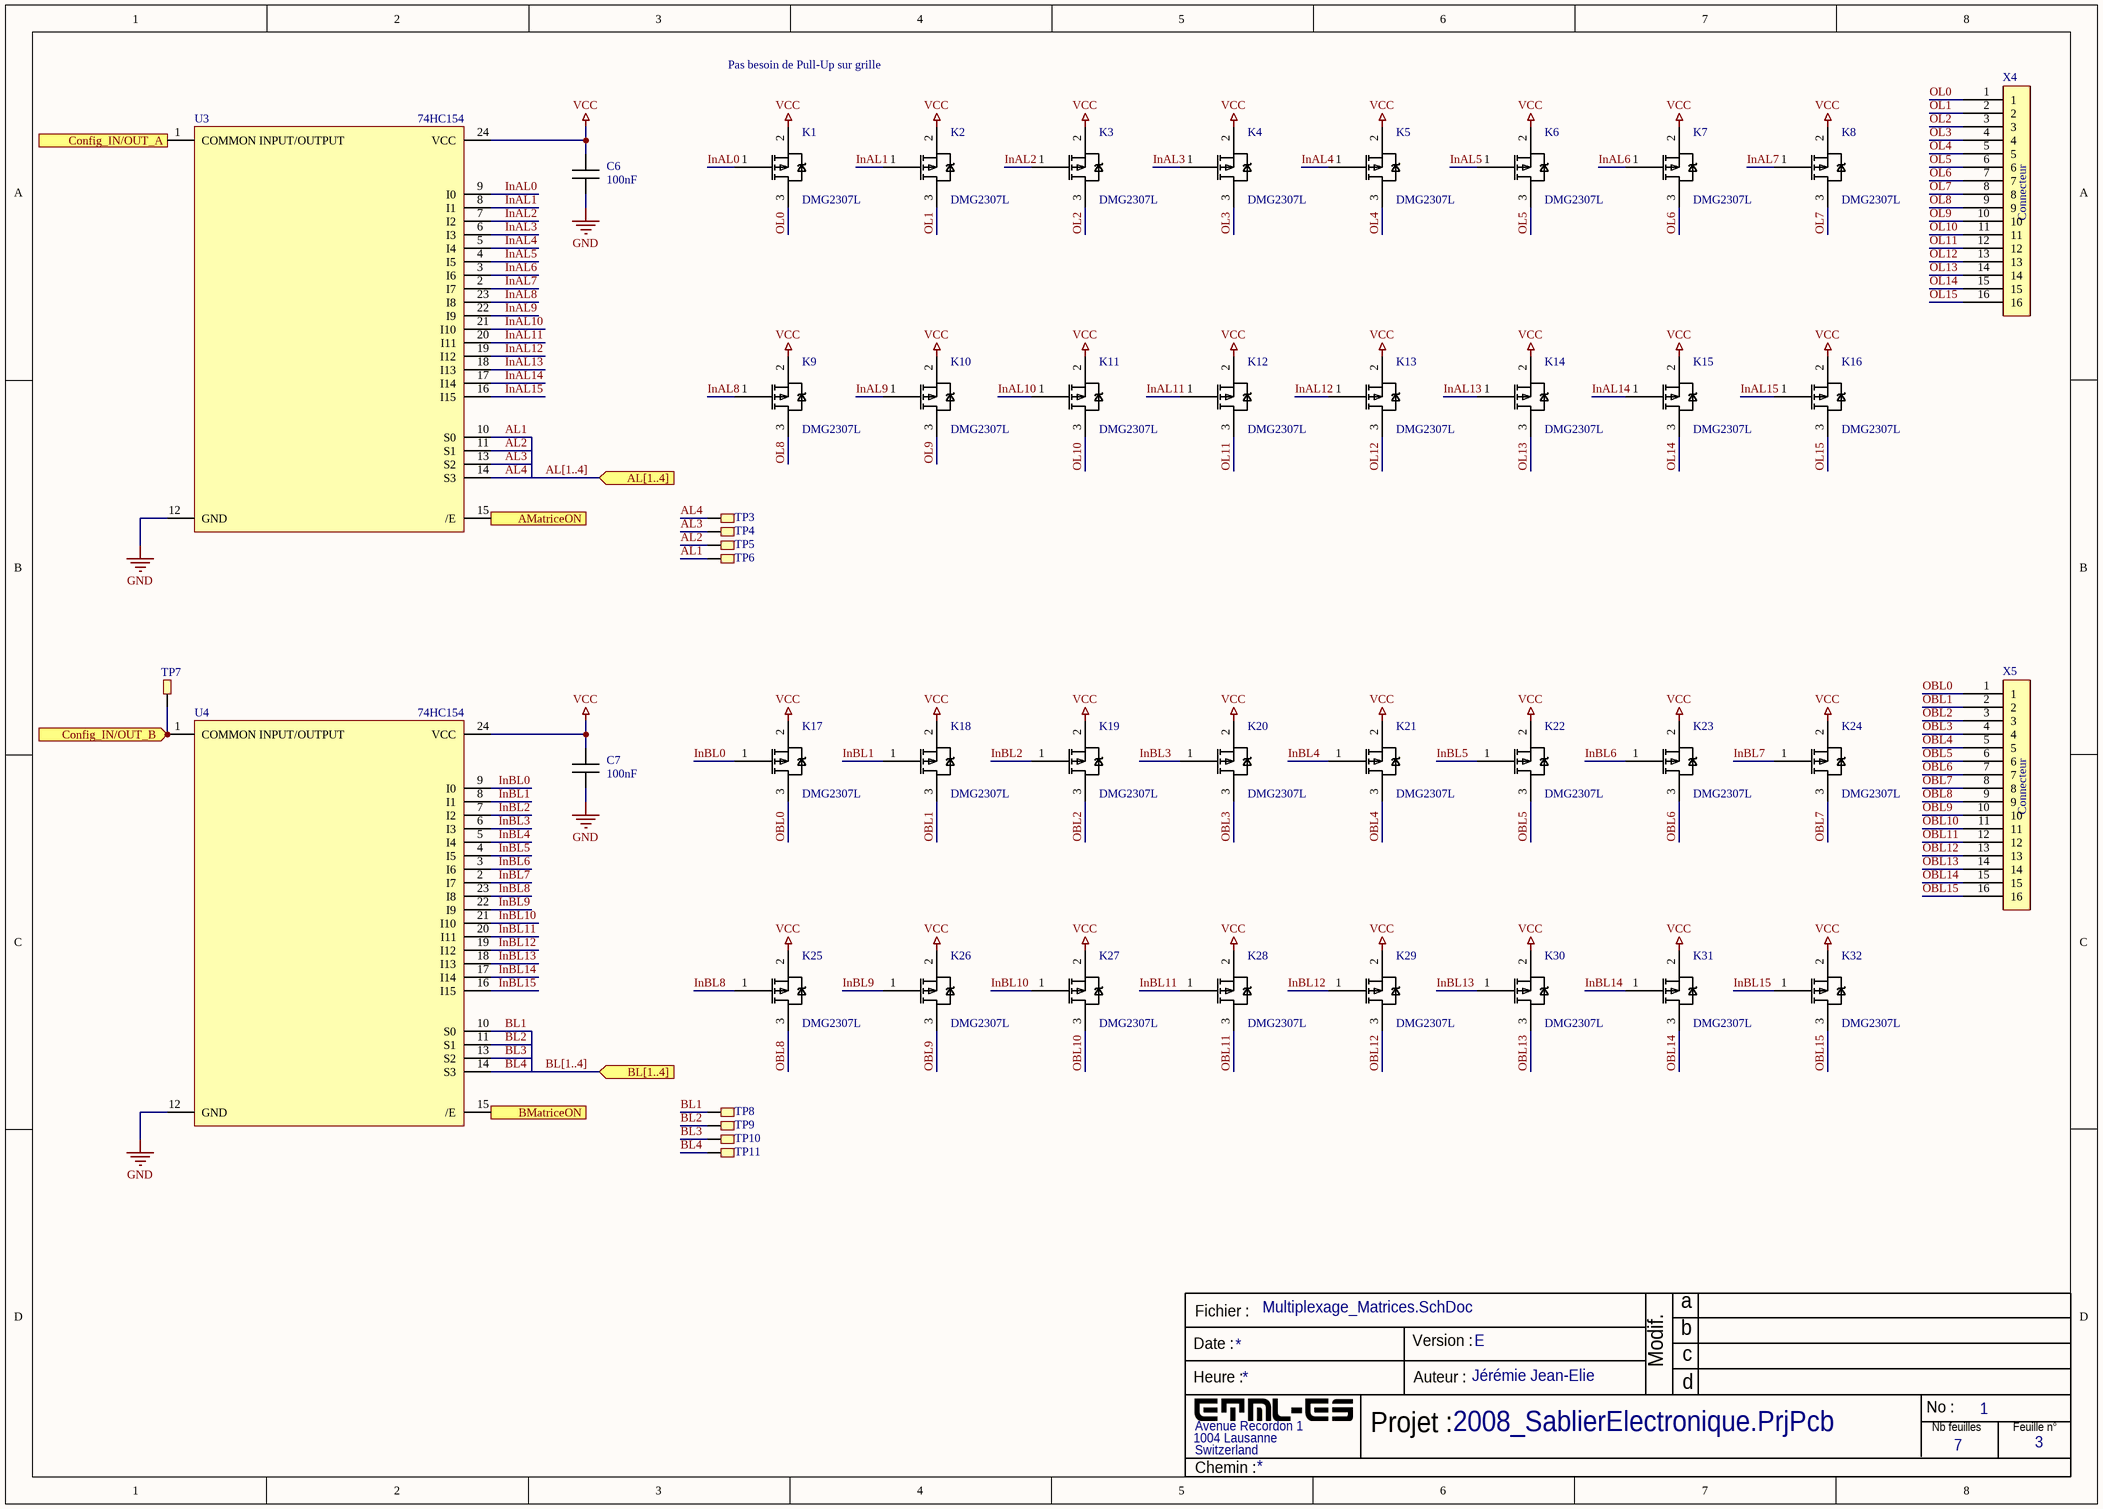
[diagram p3: Multiplexage_Matrices.SchDoc]

### Parts
C6  100nF  [CAPC1608X08M]
C7  100nF  [CAPC1608X08M]
K1  DMG2307L  [SOT90P240X110-3M]
K2  DMG2307L  [SOT90P240X110-3M]
K3  DMG2307L  [SOT90P240X110-3M]
K4  DMG2307L  [SOT90P240X110-3M]
K5  DMG2307L  [SOT90P240X110-3M]
K6  DMG2307L  [SOT90P240X110-3M]
K7  DMG2307L  [SOT90P240X110-3M]
K8  DMG2307L  [SOT90P240X110-3M]
K9  DMG2307L  [SOT90P240X110-3M]
K10  DMG2307L  [SOT90P240X110-3M]
K11  DMG2307L  [SOT90P240X110-3M]
K12  DMG2307L  [SOT90P240X110-3M]
K13  DMG2307L  [SOT90P240X110-3M]
K14  DMG2307L  [SOT90P240X110-3M]
K15  DMG2307L  [SOT90P240X110-3M]
K16  DMG2307L  [SOT90P240X110-3M]
K17  DMG2307L  [SOT90P240X110-3M]
K18  DMG2307L  [SOT90P240X110-3M]
K19  DMG2307L  [SOT90P240X110-3M]
K20  DMG2307L  [SOT90P240X110-3M]
K21  DMG2307L  [SOT90P240X110-3M]
K22  DMG2307L  [SOT90P240X110-3M]
K23  DMG2307L  [SOT90P240X110-3M]
K24  DMG2307L  [SOT90P240X110-3M]
K25  DMG2307L  [SOT90P240X110-3M]
K26  DMG2307L  [SOT90P240X110-3M]
K27  DMG2307L  [SOT90P240X110-3M]
K28  DMG2307L  [SOT90P240X110-3M]
K29  DMG2307L  [SOT90P240X110-3M]
K30  DMG2307L  [SOT90P240X110-3M]
K31  DMG2307L  [SOT90P240X110-3M]
K32  DMG2307L  [SOT90P240X110-3M]
TP3  TestPoint  [KEYSTONE_5019]  (value not drawn)
TP4  TestPoint  [KEYSTONE_5019]  (value not drawn)
TP5  TestPoint  [KEYSTONE_5019]  (value not drawn)
TP6  TestPoint  [KEYSTONE_5019]  (value not drawn)
TP7  5019  [KEYSTONE_5019]  (value not drawn)
TP8  TestPoint  [KEYSTONE_5019]  (value not drawn)
TP9  TestPoint  [KEYSTONE_5019]  (value not drawn)
TP10  TestPoint  [KEYSTONE_5019]  (value not drawn)
TP11  TestPoint  [KEYSTONE_5019]  (value not drawn)
U3  74HC154  [SOP127P1030X265-24N]
U4  74HC154  [SOP127P1030X265-24N]
X4  (no value)  [MOLEX_2x8]
X5  (no value)  [MOLEX_2x8]

### Ports
AL[1..4] (in, see Schema_bloc[2B], Microcontroleur[1B]), AMatriceON (in, see Schema_bloc[2C], Microcontroleur[1C]), BL[1..4] (in, see Schema_bloc[2B], Microcontroleur[1B]), BMatriceON (in, see Schema_bloc[2C], Microcontroleur[1C]), Config_IN/OUT_A (in, see Schema_bloc[2B], Microcontroleur[1B]), Config_IN/OUT_B (in, see Schema_bloc[2C], Microcontroleur[1C])

### Nets
GND: C6.1 C7.1 U3.12(GND) U4.12(GND)
VCC: C6.2 C7.2 K1.2(S) K2.2(S) K3.2(S) K4.2(S) K5.2(S) K6.2(S) K7.2(S) K8.2(S) K9.2(S) K10.2(S) K11.2(S) K12.2(S) K13.2(S) K14.2(S) K15.2(S) K16.2(S) K17.2(S) K18.2(S) K19.2(S) K20.2(S) K21.2(S) K22.2(S) K23.2(S) K24.2(S) K25.2(S) K26.2(S) K27.2(S) K28.2(S) K29.2(S) K30.2(S) K31.2(S) K32.2(S) U3.24(VCC) U4.24(VCC)
AL1: TP6.1 U3.10(S0)
AL2: TP5.1 U3.11(S1)
AL3: TP4.1 U3.13(S2)
AL4: TP3.1 U3.14(S3)
BL1: TP8.1 U4.10(S0)
BL2: TP9.1 U4.11(S1)
BL3: TP10.1 U4.13(S2)
BL4: TP11.1 U4.14(S3)
InAL0: K1.1(G) U3.9(I0)
InAL1: K2.1(G) U3.8(I1)
InAL2: K3.1(G) U3.7(I2)
InAL3: K4.1(G) U3.6(I3)
InAL4: K5.1(G) U3.5(I4)
InAL5: K6.1(G) U3.4(I5)
InAL6: K7.1(G) U3.3(I6)
InAL7: K8.1(G) U3.2(I7)
InAL8: K9.1(G) U3.23(I8)
InAL9: K10.1(G) U3.22(I9)
InAL10: K11.1(G) U3.21(I10)
InAL11: K12.1(G) U3.20(I11)
InAL12: K13.1(G) U3.19(I12)
InAL13: K14.1(G) U3.18(I13)
InAL14: K15.1(G) U3.17(I14)
InAL15: K16.1(G) U3.16(I15)
InBL0: K17.1(G) U4.9(I0)
InBL1: K18.1(G) U4.8(I1)
InBL2: K19.1(G) U4.7(I2)
InBL3: K20.1(G) U4.6(I3)
InBL4: K21.1(G) U4.5(I4)
InBL5: K22.1(G) U4.4(I5)
InBL6: K23.1(G) U4.3(I6)
InBL7: K24.1(G) U4.2(I7)
InBL8: K25.1(G) U4.23(I8)
InBL9: K26.1(G) U4.22(I9)
InBL10: K27.1(G) U4.21(I10)
InBL11: K28.1(G) U4.20(I11)
InBL12: K29.1(G) U4.19(I12)
InBL13: K30.1(G) U4.18(I13)
InBL14: K31.1(G) U4.17(I14)
InBL15: K32.1(G) U4.16(I15)
OBL0: K17.3(D) X5.1
OBL1: K18.3(D) X5.2
OBL2: K19.3(D) X5.3
OBL3: K20.3(D) X5.4
OBL4: K21.3(D) X5.5
OBL5: K22.3(D) X5.6
OBL6: K23.3(D) X5.7
OBL7: K24.3(D) X5.8
OBL8: K25.3(D) X5.9
OBL9: K26.3(D) X5.10
OBL10: K27.3(D) X5.11
OBL11: K28.3(D) X5.12
OBL12: K29.3(D) X5.13
OBL13: K30.3(D) X5.14
OBL14: K31.3(D) X5.15
OBL15: K32.3(D) X5.16
OL0: K1.3(D) X4.1
OL1: K2.3(D) X4.2
OL2: K3.3(D) X4.3
OL3: K4.3(D) X4.4
OL4: K5.3(D) X4.5
OL5: K6.3(D) X4.6
OL6: K7.3(D) X4.7
OL7: K8.3(D) X4.8
OL8: K9.3(D) X4.9
OL9: K10.3(D) X4.10
OL10: K11.3(D) X4.11
OL11: K12.3(D) X4.12
OL12: K13.3(D) X4.13
OL13: K14.3(D) X4.14
OL14: K15.3(D) X4.15
OL15: K16.3(D) X4.16
NetTP7_1: TP7.1 U4.1(COMMON_INPUT/OUTPUT) ; port Config_IN/OUT_B
NetU3_1: U3.1(COMMON_INPUT/OUTPUT) ; port Config_IN/OUT_A
NetU3_15: U3.15(/E) ; port AMatriceON
NetU4_15: U4.15(/E) ; port BMatriceON

### Buses and harness runs
bus AL[1..4] = port AL[1..4]
bus BL[1..4] = port BL[1..4]

### Notes on the sheet
- Pas besoin de Pull-Up sur grille
- Fichier :
- a
- Date :
- Heure :
- Version :
- Auteur :
- Modif.
- b
- c
- d
- Projet :
- No :
- Nb feuilles
- Feuille n°
- Chemin :
- (in symbol Mâle DIN 8 x 8) Connecteur

### Library data of the parts
C6 C7 = CMP-065-000000-2: as C4 on sheet Alimentation; Voltage: 50V; Dielectric: X7R; Value: 100nF; Category: Passives; Supplier Price 1: 0.0100; Supplier Part Number 1: FAB.0603_C 100n; SubCategory: Condensateurs ceramique; Tolerance: ±10%; Supplier 1: ETML; TemperatureCoeff: NULL; Power: NULL
K1-K32 = CMP-056-000002-3: TRAN DMG2307L P-Channel Enhancement MOSFET 30V 2.5A; Manufacturer: Diodes Incorporated; IsStocked: 0; TemperatureRange: -55°C to +150°C; Power: 760mW; PN: PN-317407; SubCategory: Transistors; Manufacturer Number: DMG2307L; Supplier Part Number 1: 2061518; Supplier 1: Farnell; Category: DiscreteSemiconductors; Current: 2.5A; Supplier Price 1: 0.1060; Voltage: 30V; Value: DMG2307L
TP7 = TestPoint
X4 X5 = Mâle DIN 8 x 8
U3 U4 = 74HC154: Supplier 1: DigiKey; Supplier Part Number 1: 296-24352-1-ND

## Sheet Drivers_Matrices.SchDoc
size A3; Author: Jérémie Jean-Elie; Organization: ETML-ES; Address1: Avenue Recordon 1; Address2: 1004 Lausanne; Address3: Switzerland; Revision: 1; SheetNumber: 4; SheetTotal: 7; Version: E
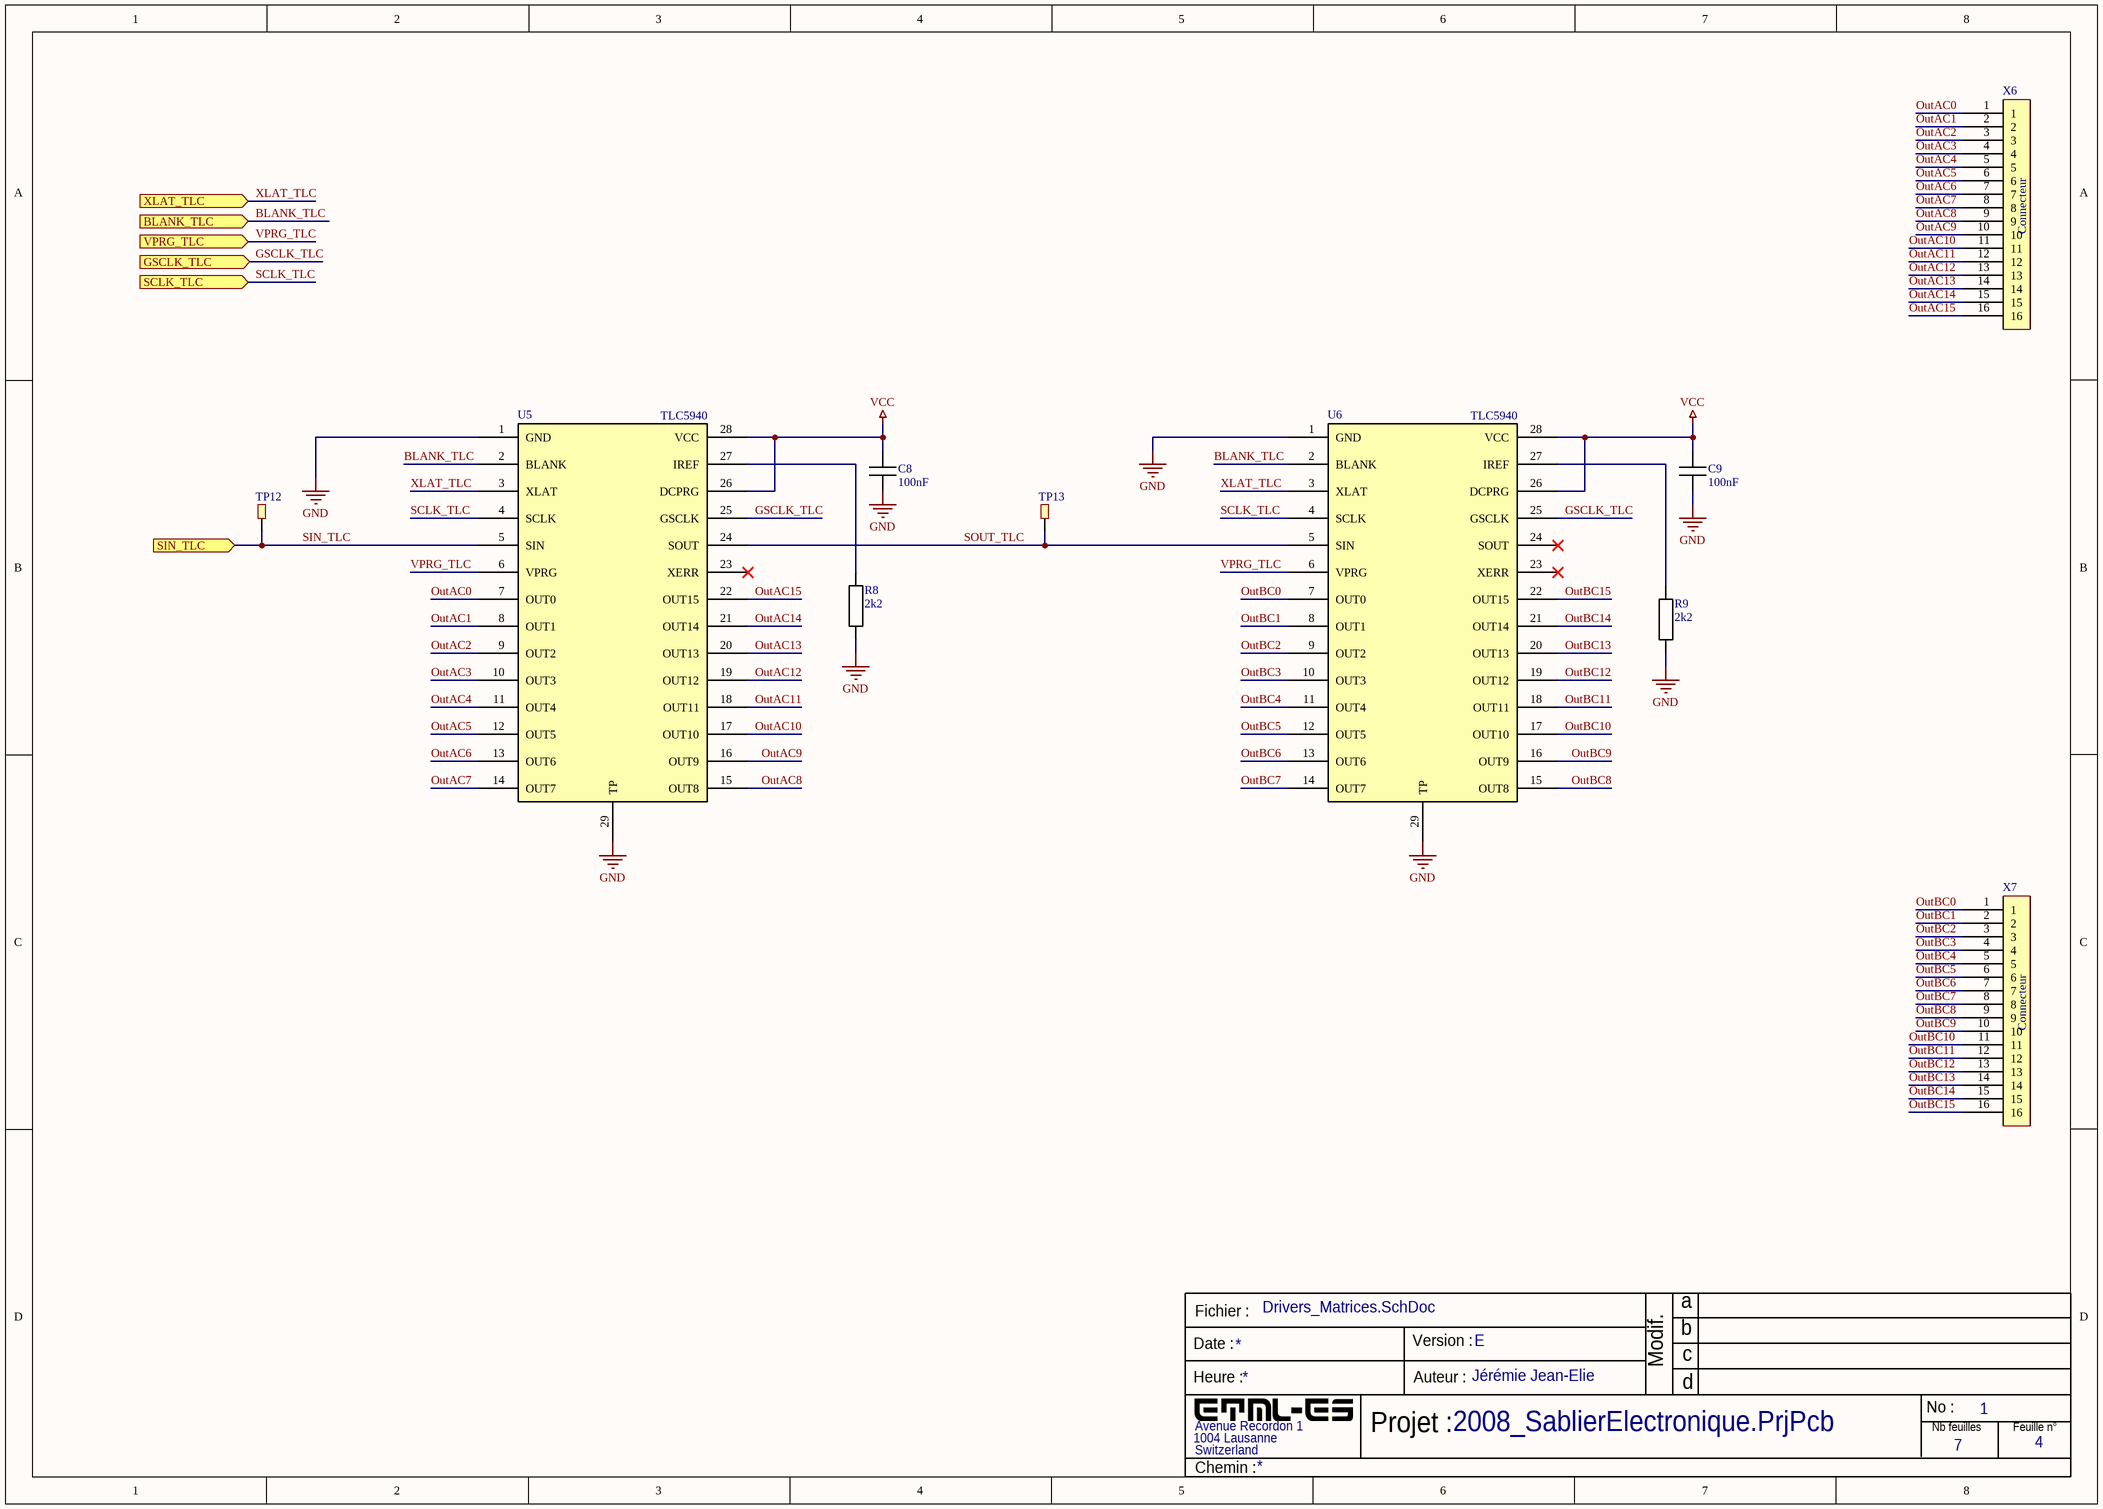
[diagram p4: Drivers_Matrices.SchDoc]

### Parts
C8  100nF  [CAPC1608X08M]
C9  100nF  [CAPC1608X08M]
R8  2k2  [RESC1608X06M]
R9  2k2  [RESC1608X06M]
TP12  TestPoint  [KEYSTONE_5019]  (value not drawn)
TP13  TestPoint  [KEYSTONE_5019]  (value not drawn)
U5  TLC5940  [TSOP65P640X120_HS-29N]
U6  TLC5940  [TSOP65P640X120_HS-29N]
X6  (no value)  [MOLEX_2x8]
X7  (no value)  [MOLEX_2x8]

### Ports
BLANK_TLC (in, see Schema_bloc[2C], Microcontroleur[4B]), GSCLK_TLC (in, see Schema_bloc[2C], Microcontroleur[4B]), SCLK_TLC (in, see Schema_bloc[2C], Microcontroleur[1B]), SIN_TLC (in, see Schema_bloc[2C], Microcontroleur[4B]), VPRG_TLC (in, see Schema_bloc[2C], Microcontroleur[4C]), XLAT_TLC (in, see Schema_bloc[2C], Microcontroleur[4B])

### Nets
GND: C8.1 C9.1 R8.1 R9.1 U5.1(GND) U5.29(TP) U6.1(GND) U6.29(TP)
VCC: C8.2 C9.2 U5.26(DCPRG) U5.28(VCC) U6.26(DCPRG) U6.28(VCC)
BLANK_TLC: U5.2(BLANK) U6.2(BLANK) ; port BLANK_TLC
GSCLK_TLC: U5.25(GSCLK) U6.25(GSCLK) ; port GSCLK_TLC
OutAC0: U5.7(OUT0) X6.1
OutAC1: U5.8(OUT1) X6.2
OutAC2: U5.9(OUT2) X6.3
OutAC3: U5.10(OUT3) X6.4
OutAC4: U5.11(OUT4) X6.5
OutAC5: U5.12(OUT5) X6.6
OutAC6: U5.13(OUT6) X6.7
OutAC7: U5.14(OUT7) X6.8
OutAC8: U5.15(OUT8) X6.9
OutAC9: U5.16(OUT9) X6.10
OutAC10: U5.17(OUT10) X6.11
OutAC11: U5.18(OUT11) X6.12
OutAC12: U5.19(OUT12) X6.13
OutAC13: U5.20(OUT13) X6.14
OutAC14: U5.21(OUT14) X6.15
OutAC15: U5.22(OUT15) X6.16
OutBC0: U6.7(OUT0) X7.1
OutBC1: U6.8(OUT1) X7.2
OutBC2: U6.9(OUT2) X7.3
OutBC3: U6.10(OUT3) X7.4
OutBC4: U6.11(OUT4) X7.5
OutBC5: U6.12(OUT5) X7.6
OutBC6: U6.13(OUT6) X7.7
OutBC7: U6.14(OUT7) X7.8
OutBC8: U6.15(OUT8) X7.9
OutBC9: U6.16(OUT9) X7.10
OutBC10: U6.17(OUT10) X7.11
OutBC11: U6.18(OUT11) X7.12
OutBC12: U6.19(OUT12) X7.13
OutBC13: U6.20(OUT13) X7.14
OutBC14: U6.21(OUT14) X7.15
OutBC15: U6.22(OUT15) X7.16
SCLK_TLC: U5.4(SCLK) U6.4(SCLK) ; port SCLK_TLC
SIN_TLC: TP12.1 U5.5(SIN) ; port SIN_TLC
SOUT_TLC: TP13.1 U5.24(SOUT) U6.5(SIN)
VPRG_TLC: U5.6(VPRG) U6.6(VPRG) ; port VPRG_TLC
XLAT_TLC: U5.3(XLAT) U6.3(XLAT) ; port XLAT_TLC
NetR8_2: R8.2 U5.27(IREF)
NetR9_2: R9.2 U6.27(IREF)

Not connected (* = marked no-connect by the designer): U5 23(XERR)*; U6 23(XERR)* 24(SOUT)*

### Notes on the sheet
- Fichier :
- a
- Date :
- Heure :
- Version :
- Auteur :
- Modif.
- b
- c
- d
- Projet :
- No :
- Nb feuilles
- Feuille n°
- Chemin :
- (in symbol Mâle DIN 8 x 8) Connecteur

### Library data of the parts
C8 C9 = CMP-065-000000-2: as C4 on sheet Alimentation; Voltage: 50V; Dielectric: X7R; Value: 100nF; Category: Passives; Supplier Price 1: 0.0100; Supplier Part Number 1: FAB.0603_C 100n; SubCategory: Condensateurs ceramique; Tolerance: ±10%; Supplier 1: ETML; TemperatureCoeff: NULL; Power: NULL
R8 R9 = CMP-066-000116-2: as R3 on sheet Alimentation; Power: 0.1W; Category: Passives; Supplier Part Number 1: FAB.0603_R 2k2; Supplier 1: ETML; SubCategory: Resistances couche epaisse; Supplier Price 1: 0.0200; Tolerance: ±1%
X6 X7 = Mâle DIN 8 x 8

## Sheet Accelerometre.SchDoc
size A4; Author: Jérémie Jean-Elie; SheetNumber: 7; SheetTotal: 7; Version: E
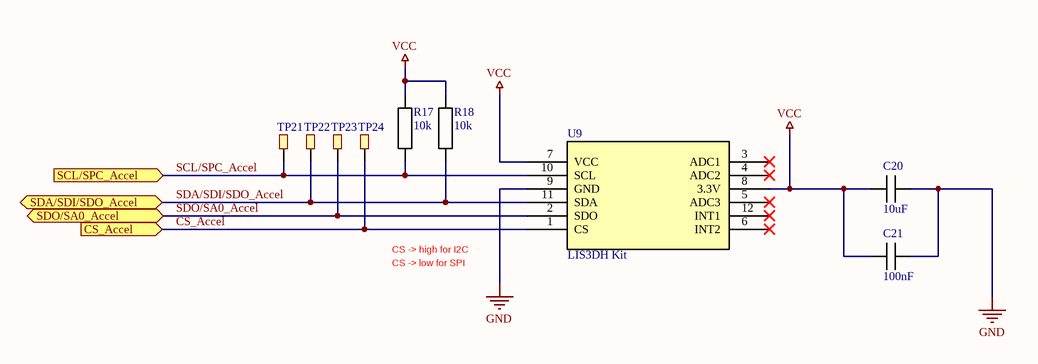
[diagram p5: Accelerometre.SchDoc]

### Parts
C20  10uF  [CAPC1608X08M]
C21  100nF  [CAPC1608X08M]
R17  10k  [RESC1608X06M]
R18  10k  [RESC1608X06M]
TP21  TestPoint  [KEYSTONE_5019]  (value not drawn)
TP22  TestPoint  [KEYSTONE_5019]  (value not drawn)
TP23  TestPoint  [KEYSTONE_5019]  (value not drawn)
TP24  TestPoint  [KEYSTONE_5019]  (value not drawn)
U9  LIS3DH Kit  [LIS3DH_Kit]

### Ports
CS_Accel (in, see Schema_bloc[3A], Microcontroleur[4B]), SCL/SPC_Accel (in, see Schema_bloc[3A], Microcontroleur[1C]), SDA/SDI/SDO_Accel (bidir, see Schema_bloc[3A], Microcontroleur[1C]), SDO/SA0_Accel (bidir, see Schema_bloc[3A], Microcontroleur[1C])

### Nets
GND: C20.2 C21.2 U9.9(GND)
VCC: C20.1 C21.1 R17.2 R18.2 U9.7(VCC) U9.8(3.3V)
CS_Accel: TP24.1 U9.1(CS) ; port CS_Accel
SCL/SPC_Accel: R17.1 TP21.1 U9.10(SCL) ; port SCL/SPC_Accel
SDA/SDI/SDO_Accel: R18.1 TP22.1 U9.11(SDA) ; port SDA/SDI/SDO_Accel
SDO/SA0_Accel: TP23.1 U9.2(SDO) ; port SDO/SA0_Accel

Not connected (* = marked no-connect by the designer): U9 3(ADC1)* 4(ADC2)* 5(ADC3)* 6(INT2)* 12(INT1)*

### Notes on the sheet
- CS -> high for I2C
- CS -> low for SPI
- Fichier :
- a
- Date :
- Heure :
- Version :
- Auteur :
- Modif.
- b
- c
- d
- Projet :
- No :
- Nb feuilles
- Feuille n°
- Chemin :

### Library data of the parts
C20 = CMP-065-000003-2: as C1 on sheet Alimentation; Supplier Price 1: 0.0944; Tolerance: ±20%; Category: Passives; Dielectric: X5R; SubCategory: Condensateurs ceramique; Supplier 1: ETML; Voltage: 10V; Supplier Part Number 1: FAB.0603_C 10uF
C21 = CMP-065-000000-2: as C4 on sheet Alimentation; Voltage: 50V; Dielectric: X7R; Value: 100nF; Category: Passives; Supplier Price 1: 0.0100; Supplier Part Number 1: FAB.0603_C 100n; SubCategory: Condensateurs ceramique; Tolerance: ±10%; Supplier 1: ETML; TemperatureCoeff: NULL; Power: NULL
R17 R18 = CMP-066-000124-2: as R2 on sheet Alimentation; Category: Passives; Tolerance: ±1%; Value: 10k; Supplier Part Number 1: FAB.0603_R 10k; Power: 0.1W; Supplier Price 1: 0.0200; Supplier 1: ETML; SubCategory: Resistances couche epaisse

## Sheet Module_Wi-Fi.SchDoc
size A4; Author: Jérémie Jean-Elie; SheetNumber: 6; SheetTotal: 7; Version: E
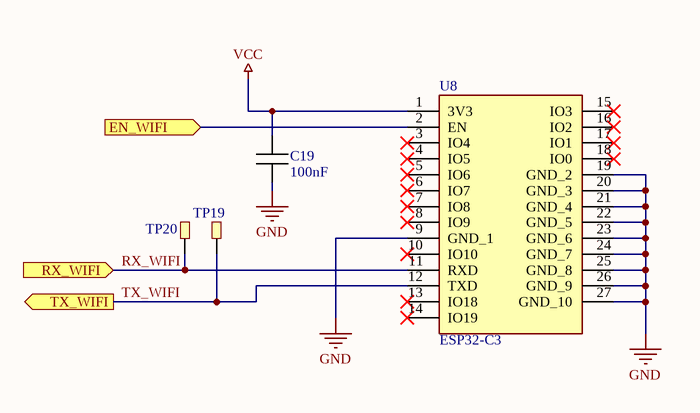
[diagram p6: Module_Wi-Fi.SchDoc]

### Parts
C19  100nF  [CAPC1608X08M]
TP19  TestPoint  [KEYSTONE_5019]  (value not drawn)
TP20  TestPoint  [KEYSTONE_5019]  (value not drawn)
U8  ESP32-C3  [ESP32_C3]

### Ports
EN_WIFI (in, see Schema_bloc[3B], Microcontroleur[4B]), RX_WIFI (in, see Schema_bloc[3B], Microcontroleur[1B]), TX_WIFI (out, see Schema_bloc[3B], Microcontroleur[1B])

### Nets
GND: C19.1 U8.9(GND_1) U8.19(GND_2) U8.20(GND_3) U8.21(GND_4) U8.22(GND_5) U8.23(GND_6) U8.24(GND_7) U8.25(GND_8) U8.26(GND_9) U8.27(GND_10)
VCC: C19.2 U8.1(3V3)
RX_WIFI: TP20.1 U8.11(RXD) ; port RX_WIFI
TX_WIFI: TP19.1 U8.12(TXD) ; port TX_WIFI
NetU7_60: U8.2(EN) ; port EN_WIFI

Not connected (* = marked no-connect by the designer): U8 3(IO4)* 4(IO5)* 5(IO6)* 6(IO7)* 7(IO8)* 8(IO9)* 10(IO10)* 13(IO18)* 14(IO19)* 15(IO3)* 16(IO2)* 17(IO1)* 18(IO0)*

### Notes on the sheet
- Fichier :
- a
- Date :
- Heure :
- Version :
- Auteur :
- Modif.
- b
- c
- d
- Projet :
- No :
- Nb feuilles
- Feuille n°
- Chemin :

### Library data of the parts
C19 = CMP-065-000000-2: as C4 on sheet Alimentation; Voltage: 50V; Dielectric: X7R; Value: 100nF; Category: Passives; Supplier Price 1: 0.0100; Supplier Part Number 1: FAB.0603_C 100n; SubCategory: Condensateurs ceramique; Tolerance: ±10%; Supplier 1: ETML; TemperatureCoeff: NULL; Power: NULL

## Nets that join several sheets
GND: Alimentation (15 pins), Microcontroleur (25 pins), Multiplexage_Matrices (C6.1 C7.1 U3.12 U4.12), Drivers_Matrices (8 pins), Accelerometre (C20.2 C21.2 U9.9), Module_Wi-Fi (11 pins)
VCC: Alimentation (X1.1), Microcontroleur (19 pins), Multiplexage_Matrices (36 pins), Drivers_Matrices (6 pins), Accelerometre (6 pins), Module_Wi-Fi (C19.2 U8.1)
AL1: Microcontroleur (U7.11), Multiplexage_Matrices (TP6.1 U3.10)
AL2: Microcontroleur (U7.12), Multiplexage_Matrices (TP5.1 U3.11)
AL3: Microcontroleur (U7.13), Multiplexage_Matrices (TP4.1 U3.13)
AL4: Microcontroleur (U7.14), Multiplexage_Matrices (TP3.1 U3.14)
BL1: Microcontroleur (U7.21), Multiplexage_Matrices (TP8.1 U4.10)
BL2: Microcontroleur (U7.22), Multiplexage_Matrices (TP9.1 U4.11)
BL3: Microcontroleur (U7.23), Multiplexage_Matrices (TP10.1 U4.13)
BL4: Microcontroleur (U7.24), Multiplexage_Matrices (TP11.1 U4.14)
BLANK_TLC: Microcontroleur (U7.53), Drivers_Matrices (U5.2 U6.2)
CS_Accel: Microcontroleur (U7.42), Accelerometre (TP24.1 U9.1)
GSCLK_TLC: Microcontroleur (U7.46), Drivers_Matrices (U5.25 U6.25)
NetTP7_1: Microcontroleur (U7.30), Multiplexage_Matrices (TP7.1 U4.1)
NetU2_3: Alimentation (U2.3), Microcontroleur (U7.54)
NetU2_4: Alimentation (U2.4), Microcontroleur (U7.55)
NetU2_9: Alimentation (U2.9), Microcontroleur (U7.59)
NetU2_17: Alimentation (U2.17), Microcontroleur (U7.58)
NetU3_1: Microcontroleur (U7.18), Multiplexage_Matrices (U3.1)
NetU3_15: Microcontroleur (U7.27), Multiplexage_Matrices (U3.15)
NetU4_15: Microcontroleur (U7.28), Multiplexage_Matrices (U4.15)
NetU7_60: Microcontroleur (U7.60), Module_Wi-Fi (U8.2)
RX_WIFI: Microcontroleur (U7.6), Module_Wi-Fi (TP20.1 U8.11)
SCL/SPC_Accel: Microcontroleur (U7.29), Accelerometre (R17.1 TP21.1 U9.10)
SCLK_TLC: Microcontroleur (U7.4), Drivers_Matrices (U5.4 U6.4)
SDA/SDI/SDO_Accel: Microcontroleur (U7.31), Accelerometre (R18.1 TP22.1 U9.11)
SDO/SA0_Accel: Microcontroleur (U7.32), Accelerometre (TP23.1 U9.2)
SIN_TLC: Microcontroleur (U7.51), Drivers_Matrices (TP12.1 U5.5)
TX_WIFI: Microcontroleur (U7.5), Module_Wi-Fi (TP19.1 U8.12)
VPRG_TLC: Microcontroleur (U7.40), Drivers_Matrices (U5.6 U6.6)
XLAT_TLC: Microcontroleur (U7.52), Drivers_Matrices (U5.3 U6.3)